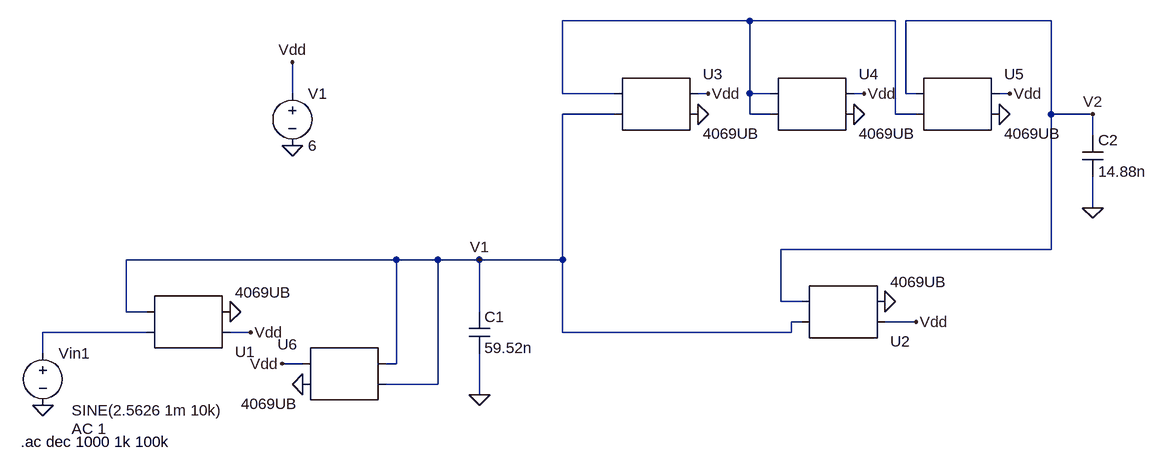
[diagram p0: schematic Draft6.asc]
* Draft6.asc
* U1: 4069UB (symbol AutoGenerated\4069UB not available, pins judged from their places): pin1=N002 pin2=V1 pin3=Vdd pin4=0
Vin1 N002 0 SINE(2.5626 1m 10k) AC 1
C1 V1 0 59.52n
* U2: 4069UB (symbol AutoGenerated\4069UB not available, pins judged from their places): pin1=V1 pin2=V2 pin3=Vdd pin4=0
* U3: 4069UB (symbol AutoGenerated\4069UB not available, pins judged from their places): pin1=N001 pin2=V1 pin3=Vdd pin4=0
* U4: 4069UB (symbol AutoGenerated\4069UB not available, pins judged from their places): pin1=N001 pin2=N001 pin3=Vdd pin4=0
* U5: 4069UB (symbol AutoGenerated\4069UB not available, pins judged from their places): pin1=V2 pin2=N001 pin3=Vdd pin4=0
V1 Vdd 0 6
C2 V2 0 14.88n
* U6: 4069UB (symbol AutoGenerated\4069UB not available, pins judged from their places): pin1=V1 pin2=V1 pin3=Vdd pin4=0
.ac dec 1000 1k 100k
.backanno
.end

* Results of the author's LTspice run, read from the files saved beside the schematic
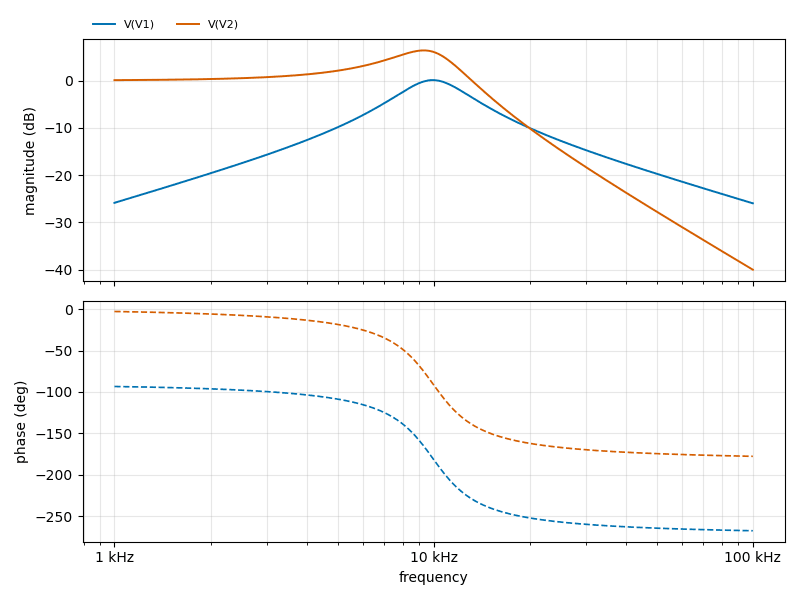
[diagram p1: AC Analysis of Draft6.asc, plotted from the saved traces]
* AC Analysis, 1 run:
*   V(V1): -25.88 dB at 1 kHz, -25.98 dB at 100 kHz, peak 0.09 dB at 9.931 kHz, 3 dB below the peak at 7.778 kHz and 12.71 kHz
*   V(V2): 0.08 dB at 1 kHz, -40.02 dB at 100 kHz, peak 6.38 dB at 9.311 kHz, 3 dB below the peak at 6.264 kHz and 11.58 kHz